# Altium schematic sheet RemoteSwitch.SchDoc
size A4; DocumentNumber: 1; SheetNumber: 1; SheetTotal: 1
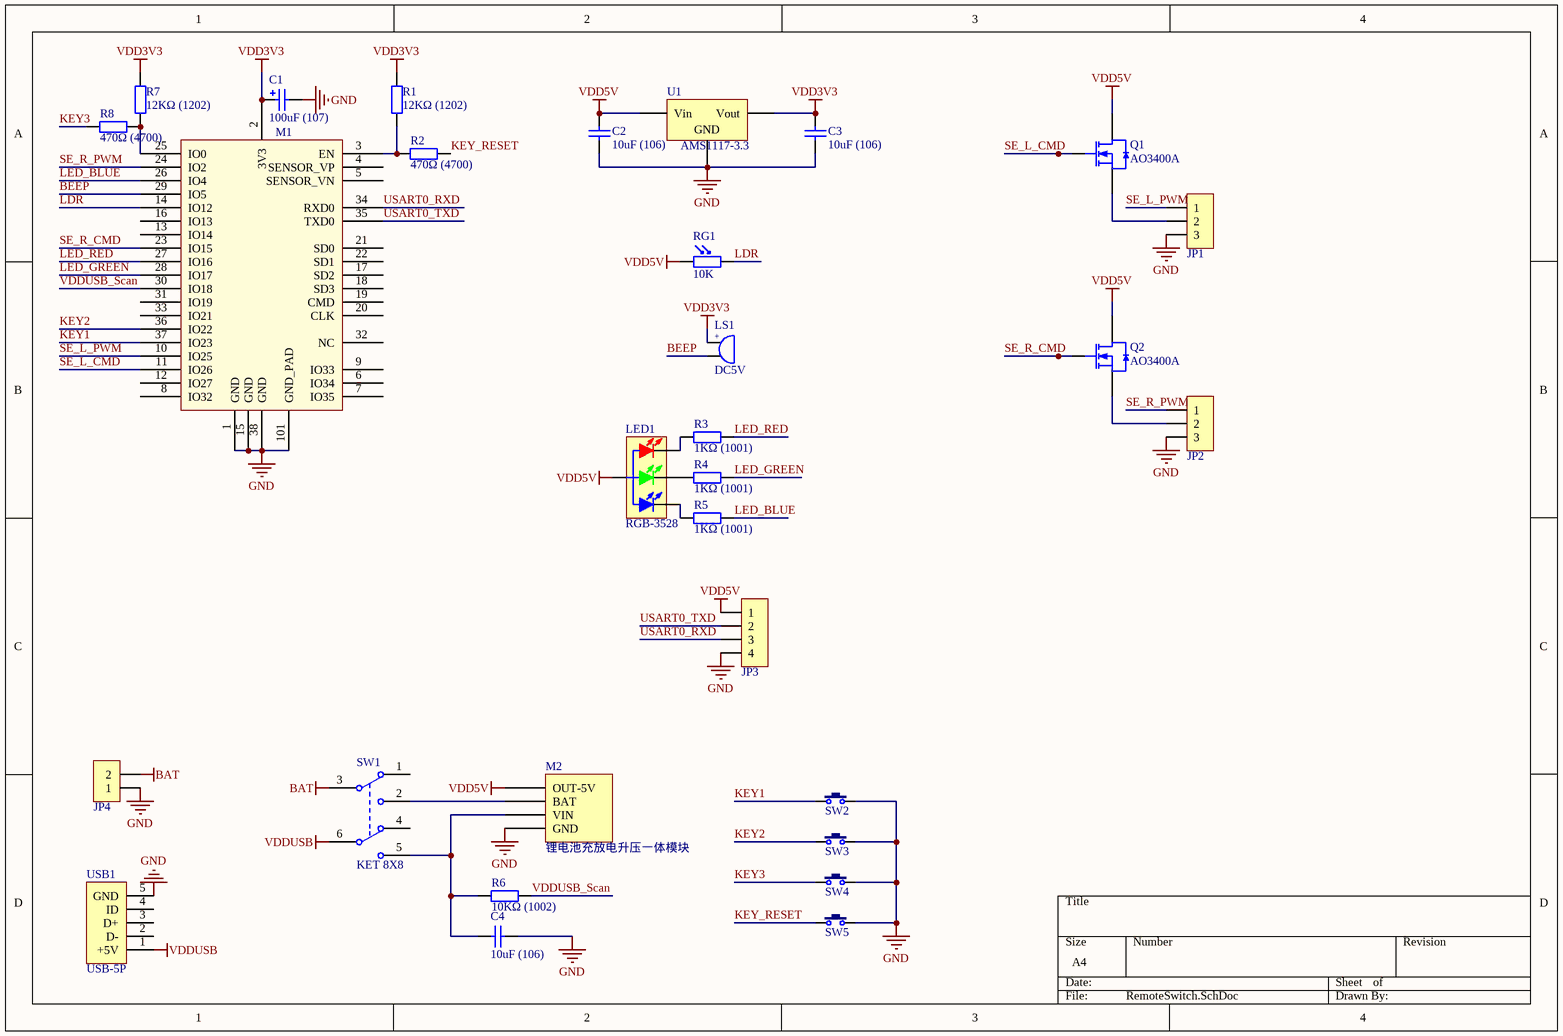
[diagram p0: RemoteSwitch.SchDoc]

## Parts
C1  100uF (107)  [CASE-B_3528]
C2  10uF (106)  [0805_C]
C3  10uF (106)  [0805_C]
C4  10uF (106)  [0805_C]
JP1  HDR-1X3  [HDR2.54-LI-3P]  (value not drawn)
JP2  HDR-1X3  [HDR2.54-LI-3P]  (value not drawn)
JP3  HDR-1X4  [HDR2.54-LI-4P]  (value not drawn)
JP4  HDR-1X2  [HDR2.54-LI-2P]  (value not drawn)
LED1  RGB-3528  [LED 3528-4Pin]
LS1  DC5V  [BEEP 5x9x5.5]
M1  ESP-32S_Module  [ESP32S]  (value not drawn)
M2  锂电池充放电升压一体模块  [PCBComponent_1]
Q1  AO3400A  [SOT-23-3L]
Q2  AO3400A  [SOT-23-3L]
R1  12KΩ (1202)  [0805_R]
R2  470Ω (4700)  [0805_R]
R3  1KΩ (1001)  [0805_R]
R4  1KΩ (1001)  [0805_R]
R5  1KΩ (1001)  [0805_R]
R6  10KΩ (1002)  [0805_R]
R7  12KΩ (1202)  [0805_R]
R8  470Ω (4700)  [0805_R]
RG1  10K  [RG5528]
SW1  KET 8X8  [KFT DIP-8X8]
SW2  6x6x5  [TSW DIP-6*6*6_V]  (value not drawn)
SW3  6x6x5  [TSW DIP-6*6*6_V]  (value not drawn)
SW4  6x6x5  [TSW DIP-6*6*6_V]  (value not drawn)
SW5  6x6x5  [TSW DIP-6*6*6_V]  (value not drawn)
U1  AMS1117-3.3  [SOT-223]
USB1  USB-5P  [USB-MICRO_A]

## Nets
BAT: JP4.2 SW1.3(NO1)
GND: C1.2 C2.1 C3.1 C4.1 JP1.3 JP2.3 JP3.4 JP4.1 M1.1(GND) M1.15(GND) M1.38(GND) M1.101(GND_PAD) M2.GND SW2.2 SW3.2 SW4.2 SW5.2 U1.1(GND) USB1.5(GND)
VDD3V3: C1.1 C3.2 LS1.1 M1.2(3V3) R1.2 R7.2 U1.2(Vout)
VDD5V: C2.2 JP3.1 LED1.4(A) M2.OUT-5V Q1.3(D) Q2.3(D) RG1.1 U1.3(Vin)
VDDUSB: SW1.6(NC2) USB1.1(+5V)
BEEP: LS1.2 M1.29(IO5)
KEY1: M1.37(IO23) SW2.1
KEY2: M1.36(IO22) SW3.1
KEY3: R8.2 SW4.1
KEY_RESET: R2.1 SW5.1
LDR: M1.14(IO12) RG1.2
LED_BLUE: M1.26(IO4) R5.1
LED_GREEN: M1.28(IO17) R4.1
LED_RED: M1.27(IO16) R3.1
SE_L_CMD: M1.11(IO26) Q1.1(G)
SE_L_PWM: JP1.1 M1.10(IO25)
SE_R_CMD: M1.23(IO15) Q2.1(G)
SE_R_PWM: JP2.1 M1.24(IO2)
USART0_RXD: JP3.3 M1.34(RXD0)
USART0_TXD: JP3.2 M1.35(TXD0)
VDDUSB_Scan: M1.30(IO18) R6.1
NetC4_2: C4.2 M2.VIN R6.2 SW1.5(COM2)
NetJP1_2: JP1.2 Q1.2(S)
NetJP2_2: JP2.2 Q2.2(S)
NetLED1_1: LED1.1(RED_K) R3.2
NetLED1_2: LED1.2(GREEN_K) R4.2
NetLED1_3: LED1.3(BULE_K) R5.2
NetM1_3: M1.3(EN) R1.1 R2.2
NetM1_25: M1.25(IO0) R7.1 R8.1
NetM2_BAT: M2.BAT SW1.2(COM2)

Not connected (* = marked no-connect by the designer): M1 4(SENSOR_VP) 5(SENSOR_VN) 6(IO34) 7(IO35) 8(IO32) 9(IO33) 12(IO27) 13(IO14) 16(IO13) 17(SD2) 18(SD3) 19(CMD) 20(CLK) 21(SD0) 22(SD1) 31(IO19) 32(NC) 33(IO21); SW1 1(NC1) 4(NO2); USB1 2(D-) 3(D+) 4(ID)

## Notes on the sheet
- (in symbol BEEP) +

## Library data of the parts
C1 = 3528 100uF (107) 10% 6.3V: 钽电容; ComponentLink1Description: 供应商链接; ComponentLink1URL: http://www.szlcsc.com/product/details_16815.html; Package: 3528; Supplier: LC; SuppliersPartNumber: C16133
C2-C4 = 0805 10uF (106) 10% 25V: 贴片电容; ComponentLink1Description: 供应商链接; ComponentLink1URL: http://www.szlcsc.com/product/details_16532.html; Package: 0805; Supplier: LC; SuppliersPartNumber: C15850
JP1 JP2 = Header 3: 3P接插件; BOM名称: 3P接插件
JP3 = Header 4: 4P接插件; BOM名称: 4P接插件
JP4 = Header 2: 2P接插件; BOM名称: 2P接插件
LED1 = LED-RGB 3528: 3528三基色LED; BOM名称: 三基色LED
LS1 = BEEP: 蜂鸣器; BOM名称: 蜂鸣器
M1 = ESP32S_Module: Esp-32S; Datasheet: https://espressif.com/sites/default/files/documentation/esp_wroom_32_datasheet_en.pdf
Q1 Q2 = AO3400A N道沟 X0YV1T SOT-23: MOS(场效应管); ComponentLink1Description: 供应商链接; ComponentLink1URL: http://www.szlcsc.com/product/details_21629.html; Package: SOT-23; Supplier: LC; SuppliersPartNumber: C20917
R1 R7 = 0805 12KΩ (1202) 1%: 贴片电阻; ComponentLink1Description: 供应商链接; ComponentLink1URL: http://www.szlcsc.com/product/details_18132.html; Package: 0805; Supplier: LC; SuppliersPartNumber: C17444
R2 R8 = 0805 470Ω (4700) 1%: 贴片电阻; ComponentLink1Description: 供应商链接; ComponentLink1URL: http://www.szlcsc.com/product/details_18398.html; Package: 0805; Supplier: LC; SuppliersPartNumber: C17710
R3-R5 = 0805 1KΩ (1001) 1%: 贴片电阻; ComponentLink1Description: 供应商链接; ComponentLink1URL: http://www.szlcsc.com/product/details_18201.html; Package: 0805; Supplier: LC; SuppliersPartNumber: C17513
R6 = 0805 10KΩ (1002) 1%: 贴片电阻; ComponentLink1Description: 供应商链接; ComponentLink1URL: http://www.szlcsc.com/product/details_18102.html; Package: 0805; Supplier: LC; SuppliersPartNumber: C17414
RG1 = RG: 光敏电阻; BOM名称: 光敏电阻
SW1 = KET 8X8: 8*8自锁开关; BOM名称: 8*8自锁开关
SW2-SW5 = TSW DIP-6x6_V: 侧按直插6x6轻触开关; BOM名称: 直插6x6轻触开关
U1 = SOT-223 AMS1117-3.3: 低压差线性稳压(LDO); ComponentLink1Description: 供应商链接; ComponentLink1URL: http://www.szlcsc.com/product/details_6652.html; Package: SOT-223; Supplier: LC; SuppliersPartNumber: C6186
USB1 = USB-5P: 微型USB母座; BOM名称: 微型USB母座